# Altium schematic sheet Accelerometer 3-AXIS - BMA180.SchDoc: Accelerometer, 3-Axis - SPI
size A4; Organization: Altium Limited; Address1: 3 Minna Close; Address2: Belrose; Address3: NSW 2085; Address4: Australia
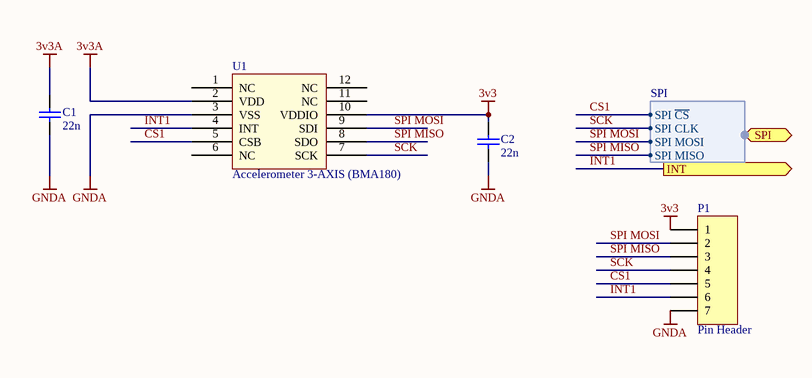
[diagram p0: Accelerometer 3-AXIS - BMA180.SchDoc]

## Parts
C1  22n  [C0805]
C2  22n  [C0805]
P1  Pin Header  [PH1x7_2.54]
U1  Accelerometer 3-AXIS (BMA180)  [BMA180]

## Ports
INT (out), SPI (harness SPI)

## Harnesses
SPI: SPI ~{CS}, SPI CLK, SPI MOSI, SPI MISO

## Nets
3v3: C2.2 P1.1 U1.10(VDDIO)
3v3A: C1.2 U1.2(VDD)
GNDA: C1.1 C2.1 P1.7 U1.3(VSS)
CS1: P1.5 U1.5(CSB) ; port SPI.SPI ~{CS}
INT1: P1.6 U1.4(INT) ; port INT
SCK: P1.4 U1.7(SCK) ; port SPI.SPI CLK
SPI MISO: P1.3 U1.8(SDO) ; port SPI.SPI MISO
SPI MOSI: P1.2 U1.9(SDI) ; port SPI.SPI MOSI

Not connected (* = marked no-connect by the designer): U1 1(NC) 6(NC) 11(NC) 12(NC)

## Notes on the sheet
- Disclaimer
  Any design and information, hardware or software  is provided on an "as-is" basis without warranty of any kind and any express or implied warranties, including, but not limited to, the implied warranties of merchantability and fitness for a particular purpose are disclaimed. In no event shall wnpd (or KeaDrone)be liable for any direct, indirect, incidental, special, exemplary, or consequential damages (including, but not limited to, procurement of substitute goods or services; loss of use, data, or profits; or business interruption) however caused and on any theory of liability, whether in contract, strict liability, or tort (including negligence or otherwise) arising in any way out of the use of this firmware, hardware, software or information, even if wnpd (or KeaDrone) has been advised by user of the possibility of such potential loss or damage. The user agrees to hold wnpd (or KeaDrone) harmless from and against any and all claims, losses, liabilities and expenses.
- Title
- Size:
- Date:
- A4
- Name:
- Time:
- Ing. W. Pietersz
- Revision:
- Sheet
- of
- WillyPietersz@gmail.com
- Contact:
- -
- www.wnpd.nl
- File:

## Library data of the parts
C1 C2 = 22n: Tolerance: 0.1; LatestRevision Note: Initial Release; Part Number: 22n; Value: 22n; Package: 0805; Component Type: Standard; LatestRevision Date: 31-7-2010; Author: Willy Pietersz; ComponentLink1Description: Manufacturer; ComponentLink2Description: Datasheet
P1 = PH1x7: Con1x7; Part Number: PH1x7; Pitch: 2.54; LatestRevision Note: Initial Release; Type: Pin Header; Number Of Pins: 7; Component Type: Standard; LatestRevision Date: 23-11-2010; Author: Willy Pietersz; Supplier 2: Farnell
U1 = BMA180: Part Number: BMA180; Component Type: Sensor; Supplier 1: Digikey; Supplier Part Number 1: 828-1019-1-ND; ComponentLink1Description: Datasheet; ComponentLink1URL: http://www.bosch-sensortec.com/content/language1/downloads/BST-BMA180-FL000-03.pdf